# EAGLE design tda2009 (EAGLE 6.3)
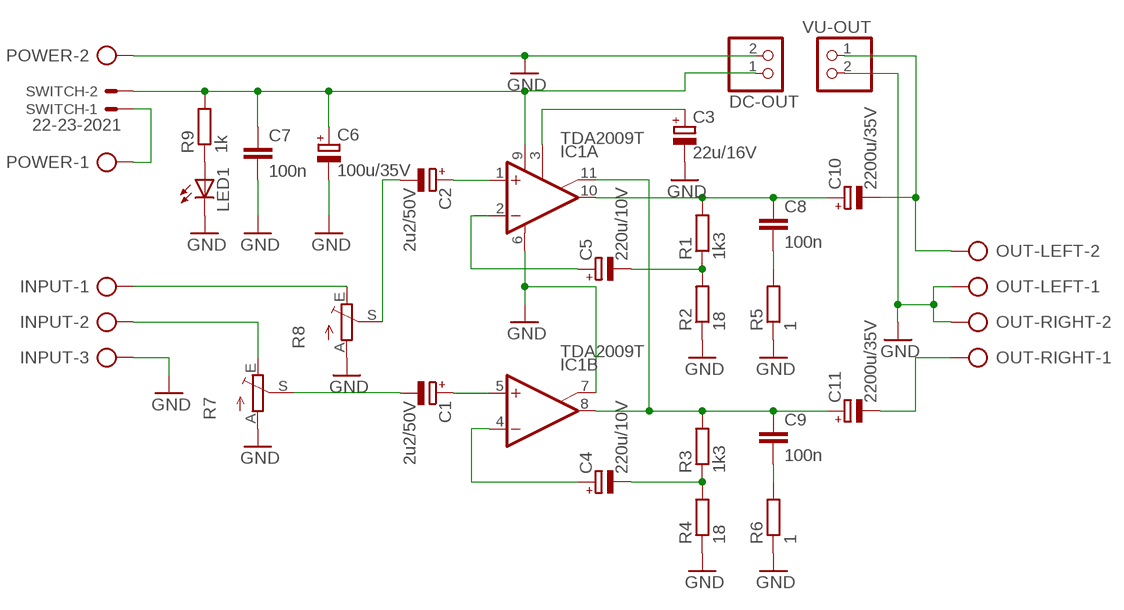
[diagram p0: schematic, sheet 1]

## Parts
C1  2u2/50V  CPOL-EUE2.5-5  [E2,5-5]
C2  2u2/50V  CPOL-EUE2.5-5  [E2,5-5]
C3  22u/16V  CPOL-EUE2.5-5  [E2,5-5]
C4  220u/10V  CPOL-EUE2.5-6  [E2,5-6]
C5  220u/10V  CPOL-EUE2.5-6  [E2,5-6]
C6  100u/35V  CPOL-EUE3.5-8  [E3,5-8]
C7  100n  C-EU025-025X050  [C025-025X050]
C8  100n  C-EU025-025X050  [C025-025X050]
C9  100n  C-EU025-025X050  [C025-025X050]
C10  2200u/35V  CPOL-EUE7.5-16  [E7,5-16]
C11  2200u/35V  CPOL-EUE7.5-16  [E7,5-16]
DC-OUT  PINHD-1X2  [1X02]
IC1  TDA2009T  [SIP11]
INPUT  AK300/3  [AK300/3]
LED1  LED5MM  [LED5MM]
OUT-LEFT  AK300/2  [AK300/2]
OUT-RIGHT  AK300/2  [AK300/2]
POWER  AK300/2  [AK300/2]
R1  1k3  R-EU_0207/10  [0207/10]
R2  18  R-EU_0207/10  [0207/10]
R3  1k3  R-EU_0207/10  [0207/10]
R4  18  R-EU_0207/10  [0207/10]
R5  1  R-EU_0207/10  [0207/10]
R6  1  R-EU_0207/10  [0207/10]
R7  TRIM_EU-RJ9W  [RJ9W]
R8  TRIM_EU-RJ9W  [RJ9W]
R9  1k  R-EU_0207/10  [0207/10]
SWITCH  22-23-2021  [22-23-2021]
VU-OUT  PINHD-1X2  [1X02]

## Nets
GND: C3.- C6.- C7.2 DC-OUT.2 IC1.6(A:GND) IC1.7(B:BTSP) INPUT.3 LED1.K(C) OUT-LEFT.1 OUT-RIGHT.2 POWER.2 R2.1 R4.1 R5.1 R6.1 R7.A R8.A VU-OUT.2
N$1: C5.- R1.1 R2.2
N$2: C4.- R3.1 R4.2
N$3: C8.2 R5.2
N$4: C9.2 R6.2
N$5: C9.1 C11.+ IC1.8(B:OUT) IC1.11(A:BTSP) R3.2
N$6: C8.1 C10.+ IC1.10(A:OUT) R1.2
N$7: C1.+ IC1.5(B:+IN)
N$8: C2.+ IC1.1(A:+IN)
N$9: INPUT.2 R7.E
N$10: C3.+ IC1.3(A:SVRR)
N$11: C5.+ IC1.2(A:-IN)
N$12: C4.+ IC1.4(B:-IN)
N$13: INPUT.1 R8.E
N$14: C1.- R7.S
N$15: C10.- OUT-LEFT.2 VU-OUT.1
N$16: C11.- OUT-RIGHT.1
N$17: C2.- R8.S
N$18: LED1.A R9.1
N$19: POWER.1 SWITCH.1
N$21: C6.+ C7.1 DC-OUT.1 IC1.9(A:V+) R9.2 SWITCH.2

## Library data of the parts
C1-C6 C10 C11 = rcl:CPOL-EU: POLARIZED CAPACITOR, European symbol
C7-C9 = rcl:C-EU: CAPACITOR, European symbol
DC-OUT VU-OUT = pinhead:PINHD-1X2: PIN HEADER
IC1 = linear:TDA2009: Power OP AMP
INPUT = con-ptr500:AK300/3: CONNECTOR
LED1 = led:LED: LED OSRAM: - CHIPLED LG R971, LG N971, LY N971, LG Q971, LY Q971, LO R971, LY R971 LH N974, LH R974 LS Q976, LO Q976, LY Q976 LO Q996 - Hyper CHIPLED LW Q18S LB Q993, LB Q99A, LB R99A - SideLED LS A670, LO A670, LY A670, LG A670, LP A670 LB A673, LV A673, LT A673, LW A673 LH A674 LY A675 LS A676, LA A676, LO A676, LY A676, LW A676 LS A679, LY A679, LG A679 - Hyper Micro SIDELED® LS Y876, LA Y876, LO Y876, LY Y876 LT Y87S - SmartLED LW L88C, LW L88S LB L89C, LB L89S, LG L890 LS L89K, LO L89K, LY L89K LS L896, LA L896, LO L896, LY L896 - TOPLED LS T670, LO T670, LY T670, LG T670, LP T670 LSG T670, LSP T670, LSY T670, LOP T670, LYG T670 LG T671, LOG T671, LSG T671 LB T673, LV T673, LT T673, LW T673 LH T674 LS T676, LA T676, LO T676, LY T676, LB T676, LH T676, LSB T676, LW T676 LB T67C, LV T67C, LT T67C, LS T67K, LO T67K, LY T67K, LW E67C LS E67B, LA E67B, LO E67B, LY E67B, LB E67C, LV E67C, LT E67C LW T67C LS T679, LY T679, LG T679 LS T770, LO T770, LY T770, LG T770, LP T770 LB T773, LV T773, LT T773, LW T773 LH T774 LS E675, LA E675, LY E675, LS T675 LS T776, LA T776, LO T776, LY T776, LB T776 LHGB T686 LT T68C, LB T68C - Hyper Mini TOPLED® LB M676 - Mini TOPLED Santana® LG M470 LS M47K, LO M47K, LY M47K Source: http://www.osram.convergy.de LUXEON: - LUMILED® LXK2-PW12-R00, LXK2-PW12-S00, LXK2-PW14-U00, LXK2-PW14-V00 LXK2-PM12-R00, LXK2-PM12-S00, LXK2-PM14-U00 LXK2-PE12-Q00, LXK2-PE12-R00, LXK2-PE12-S00, LXK2-PE14-T00, LXK2-PE14-U00 LXK2-PB12-K00, LXK2-PB12-L00, LXK2-PB12-M00, LXK2-PB14-N00, LXK2-PB14-P00, LXK2-PB14-Q00 LXK2-PR12-L00, LXK2-PR12-M00, LXK2-PR14-Q00, LXK2-PR14-R00 LXK2-PD12-Q00, LXK2-PD12-R00, LXK2-PD12-S00 LXK2-PH12-R00, LXK2-PH12-S00 LXK2-PL12-P00, LXK2-PL12-Q00, LXK2-PL12-R00 Source: www.luxeon.com KINGBRIGHT: KA-3528ASYC Source: www.kingbright.com
OUT-LEFT OUT-RIGHT POWER = con-ptr500:AK300/2: CONNECTOR
R1-R6 R9 = rcl:R-EU_: RESISTOR, European symbol
R7 R8 = pot:TRIM_EU-: POTENTIOMETER
SWITCH = con-molex:22-23-2021: .100" (2.54mm) Center Header - 2 Pin

## Board
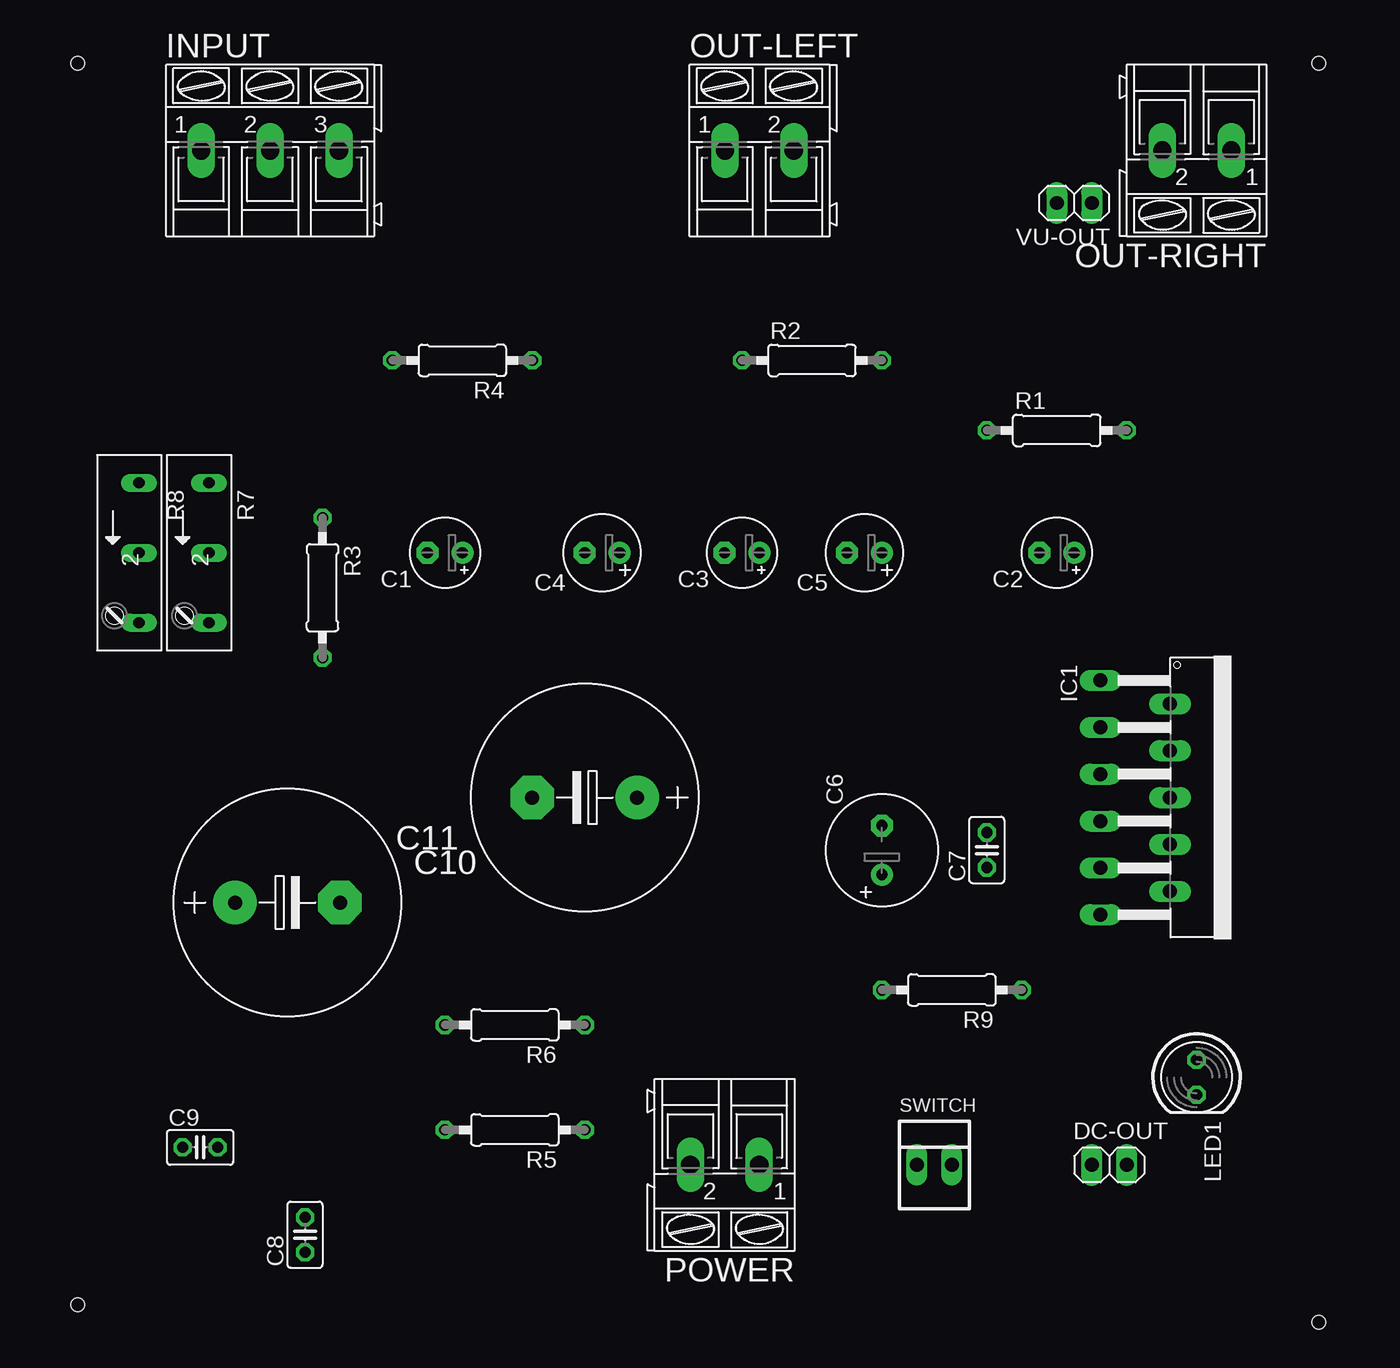
[diagram p1: board, top side]
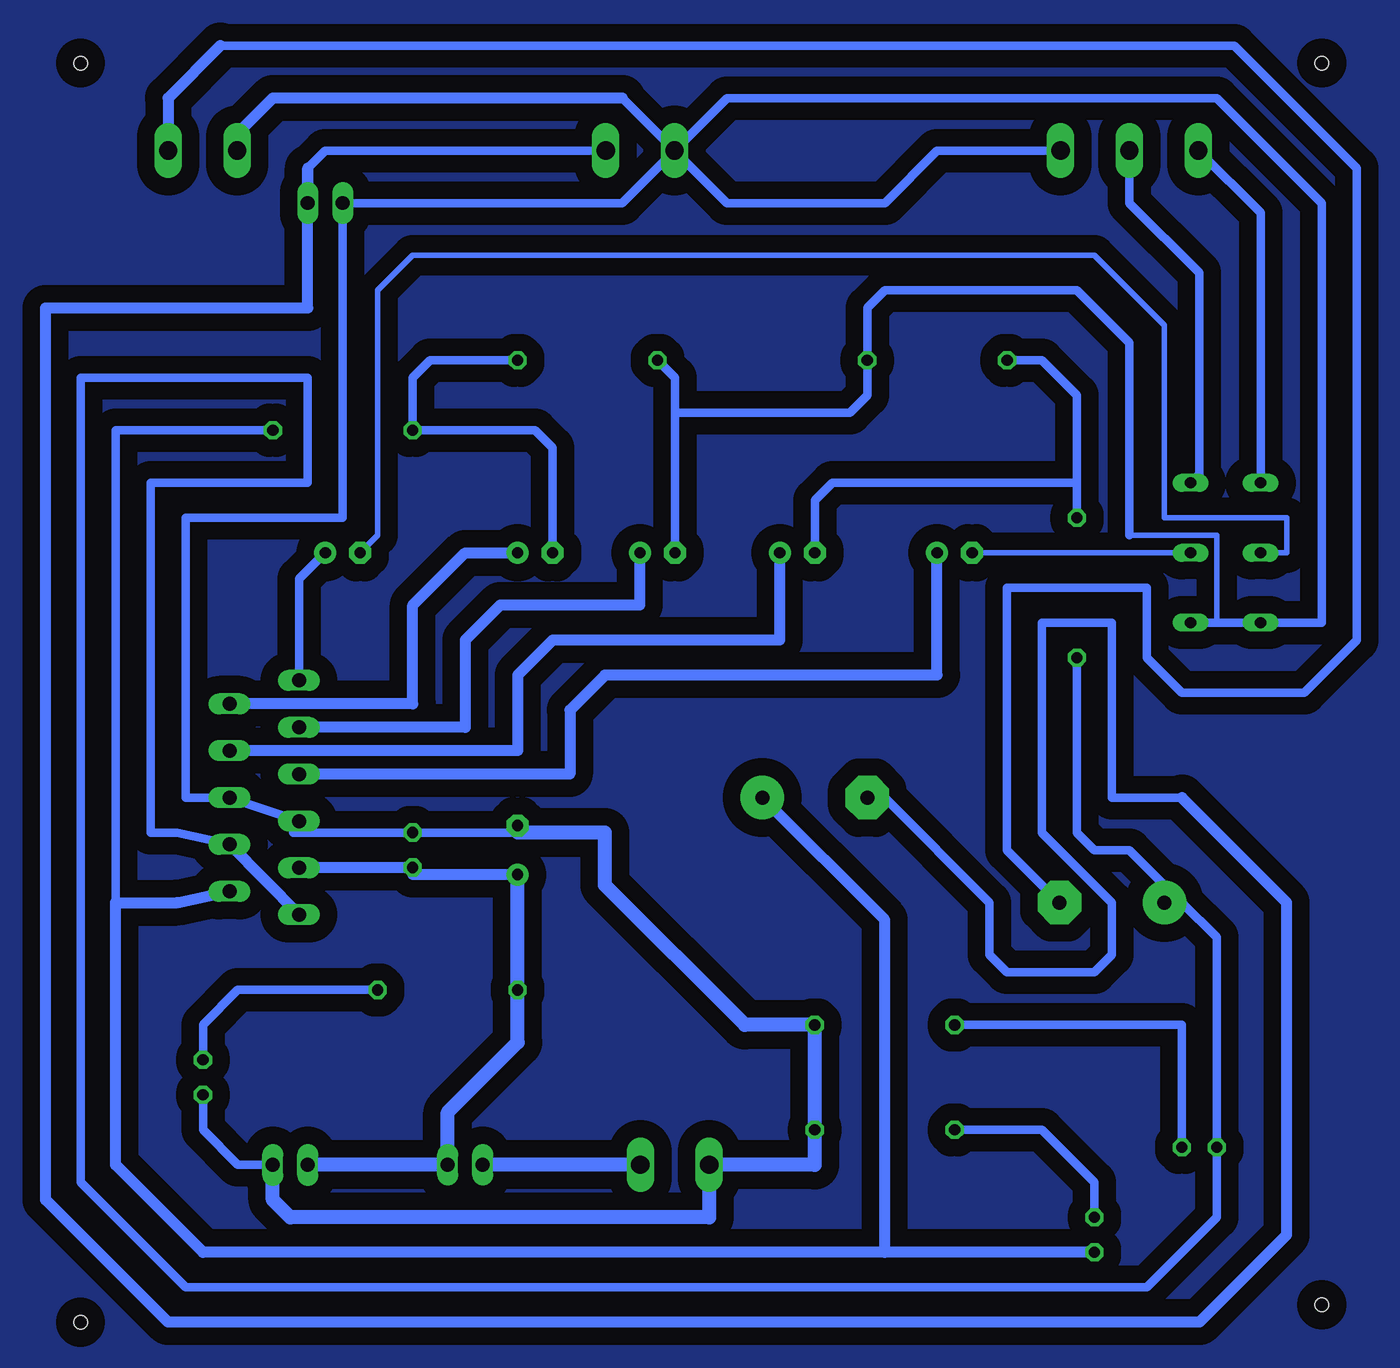
[diagram p2: board, bottom side, seen from below]

No outline drawn. Coordinates in mm, seen from the top.
Copper layers (1*16): Top 0.035mm / dielectric 1.5mm / Bottom 0.035mm
Design rules "default *": minimum track width 0.8mm, minimum drill 0.8mm, track to track 1mm, track to pad 1mm, pad to pad 1mm, via to via 1mm, smd to smd 8mil, copper to edge 40mil, drill to drill 8mil, minimum pad ring 10mil, minimum via ring 8mil, stop-mask expansion 4mil, vias tented up to drill 0mil, thermal gap 10mil
Holes 1 mm at 95.25,16.51 5.08,17.78 95.25,107.95 5.08,107.95

### Footprints (pad centres in the part's own frame; a part is rotated, then mirrored left to right if it is on the bottom)
E2,5-5 = drill 0.813 pad 1.6: + -1.27,0 | drill 0.813 pad 1.6 octagon: - 1.27,0
E2,5-6 = drill 0.813 pad 1.6: + -1.27,0 | drill 0.813 pad 1.6 octagon: - 1.27,0
E3,5-8 = drill 0.813 pad 1.6: + -1.778,0 | drill 0.813 pad 1.6 octagon: - 1.778,0
C025-025X050 = drill 0.813 octagon: 1 -1.27,0; 2 1.27,0
E7,5-16 = drill 1.016 pad 3.15: + -3.81,0 | drill 1.016 pad 3.15 octagon: - 3.81,0
1X02 = drill 1.016 long: 1 -1.27,0; 2 1.27,0
SIP11 = drill 1.016 long: 1 -8.509,-9.525; 2 -6.807,-4.47; 3 -5.105,-9.525; 4 -3.404,-4.47; 5 -1.702,-9.525; 6 0,-4.47; 7 1.702,-9.525; 8 3.404,-4.47; 9 5.105,-9.525; 10 6.807,-4.47; 11 8.509,-9.525
AK300/3 = drill 1.321 long: 1 -5.004,0; 2 0,0; 3 5.004,0
LED5MM = drill 0.813 octagon: A -1.27,0; K 1.27,0
AK300/2 = drill 1.321 long: 1 -2.515,0; 2 2.489,0
0207/10 = drill 0.813 octagon: 1 -5.08,0; 2 5.08,0
RJ9W = drill 0.813 long: A 5.08,0.635; E -5.08,0.635; S 0,0.635
22-23-2021 = drill 1 long: 1 -1.27,0; 2 1.27,0

### Placement (x,y rotation side)
C1  31.75,72.39 180 top
C2  76.2,72.39 180 top
C3  53.34,72.39 180 top
C4  43.18,72.39 180 top
C5  62.23,72.39 180 top
C6  63.5,50.8 90 top
C7  71.12,50.8 90 top
C8  21.59,22.86 90 top
C9  13.97,29.21 0 top
C10  41.91,54.61 180 top
C11  20.32,46.99 0 top
DC-OUT  80.01,27.94 0 top
IC1  88.9,54.61 270 top
INPUT  19.05,101.6 0 top
LED1  86.36,34.29 270 top
OUT-LEFT  54.61,101.6 0 top
OUT-RIGHT  86.36,101.6 180 top
POWER  52.07,27.94 180 top
R1  76.2,81.28 0 top
R2  58.42,86.36 0 top
R3  22.86,69.85 270 top
R4  33.02,86.36 180 top
R5  36.83,30.48 180 top
R6  36.83,38.1 180 top
R7  13.97,72.39 270 top
R8  8.89,72.39 270 top
R9  68.58,40.64 180 top
SWITCH  67.31,27.94 0 top
VU-OUT  77.47,97.79 180 top

### Tracks (layer width: path | path; a pad name or v marks a point on that pad's centre or on a via)
GND
  Bottom 0.406: 19.05,73.66 12.7,73.66 12.7,67.31
  Bottom 0.61: 12.7,67.31 R8.A | 12.7,67.31 5.08,67.31 5.08,97.79 12.7,105.41 48.28,105.41 OUT-LEFT.1 | 12.7,67.31 R7.A | C6.- 63.5,52.07 C7.2 79.81,52.07 IC1.7 IC1.6 87.63,54.61 87.63,74.93 76.2,74.93 VU-OUT.2 55.91,97.79 OUT-LEFT.1 | 55.88,105.41 52.07,101.6 OUT-LEFT.1 | LED1.K 86.36,30.48 83.82,27.94 DC-OUT.2 | 52.07,82.55 C3.- | 52.07,82.55 52.07,85.09 R2.1 | 19.05,73.66 19.05,87.63 22.86,91.44 36.83,91.44 38.1,90.17 R4.1 38.1,83.82 39.37,82.55 52.07,82.55 | INPUT.3 33.02,101.6 36.83,97.79 48.28,97.79 OUT-LEFT.1
  Bottom 0.813: OUT-RIGHT.2 83.87,102.82 81.28,105.41 55.88,105.41
  Bottom 1.016: 63.5,52.07 57.15,52.07 57.15,48.26 46.99,38.1 R6.1 R5.1 41.91,27.94 POWER.2 49.58,24.13 80.01,24.13 81.28,25.4 DC-OUT.2
N$1
  Bottom 0.61: R2.2 69.85,86.36 71.12,85.09 R1.1 62.23,81.28 60.96,80.01 C5.-
N$2
  Bottom 0.61: R4.2 25.4,86.36 22.86,83.82 22.86,77.47 | R3.1 22.86,77.47 | C4.- 41.91,76.2 40.64,77.47 22.86,77.47
N$3
  Bottom 0.61: C8.2 21.59,26.67 25.4,30.48 R5.2
N$4
  Bottom 0.61: R6.2 15.24,38.1 C9.2
N$5
  Bottom 0.61: IC1.8 88.24,52.07 90.17,52.07 90.17,77.47 78.74,77.47 78.74,85.09 95.25,85.09 95.25,26.67 87.63,19.05 17.78,19.05 12.7,24.13 C9.1 12.7,44.45 15.24,46.99 C11.+ 16.51,48.26 19.05,50.8 21.59,50.8 22.86,52.07 R3.2
  Bottom 0.813: IC1.8 IC1.11
N$6
  Bottom 0.61: R1.2 92.71,81.28 92.71,46.99
  Bottom 0.813: IC1.10 88.24,46.99 92.71,46.99 92.71,27.94 86.36,21.59 36.83,21.59 | C8.1 36.83,21.59 | 36.83,21.59 36.83,40.64 36.83,45.72 C10.+
N$7
  Bottom 0.813: IC1.5 59.69,56.31 59.69,60.96 57.15,63.5 33.02,63.5 C1.+
N$8
  Bottom 0.61: IC1.1 79.38,70.48 C2.+
N$9
  Bottom 0.61: INPUT.2 19.05,97.79 13.97,92.71 13.97,78.11 R7.E
N$10
  Bottom 0.813: IC1.3 67.31,59.72 67.31,66.04 64.77,68.58 54.61,68.58 C3.+
N$11
  Bottom 0.813: IC1.2 71.12,61.42 71.12,68.58 67.31,72.39 C5.+
N$12
  Bottom 0.813: IC1.4 63.5,58.01 63.5,63.5 60.96,66.04 44.45,66.04 C4.+
N$13
  Bottom 0.61: R8.E 9.53,97.08 INPUT.1
N$14
  Bottom 0.406: R7.S C1.-
N$15
  Bottom 0.61: OUT-LEFT.2 77.47,101.6 78.74,100.33 | C10.- 36.83,54.61 29.21,46.99 29.21,43.18 27.94,41.91 21.59,41.91 20.32,43.18 20.32,46.99 25.4,52.07 25.4,67.31 20.32,67.31 20.32,54.61 15.24,54.61
  Bottom 0.813: VU-OUT.1 78.74,100.33 78.74,90.17 97.79,90.17 97.79,25.4 88.9,16.51 13.97,16.51 7.62,22.86 7.62,46.99 15.24,54.61
N$16
  Bottom 0.61: C11.- 27.94,50.8 27.94,69.85 17.78,69.85 17.78,64.77 15.24,62.23 6.35,62.23 2.54,66.04 2.54,100.33 11.43,109.22 85.09,109.22
  Bottom 0.813: 85.09,109.22 88.9,105.41 88.9,101.62 OUT-RIGHT.1
N$17
  Bottom 0.406: R8.S 7.62,72.39 7.62,74.93 16.51,74.93 16.51,88.9 21.59,93.98 71.12,93.98 73.66,91.44 73.66,73.66 C2.-
N$18
  Bottom 0.61: R9.1 83.82,40.64 86.36,38.1 LED1.A
N$19
  Bottom 1.016: POWER.1 SWITCH.1
N$20
  pour Bottom (isolate 1.27, no thermals): -3.81,115.57 105.41,115.57 105.41,8.89 -3.81,8.89
N$21
  Bottom 0.61: C6.+ 63.5,49.53
  Bottom 0.813: 71.12,49.51 IC1.9 | C6.+ 71.12,49.02 71.12,49.51 | 71.12,49.51 C7.1
  Bottom 1.016: DC-OUT.1 SWITCH.2 68.58,31.75 63.5,36.83 R9.2 C6.+